# Altium schematic sheet P15-EXP_IO.SchDoc
size 817 x 513 mm
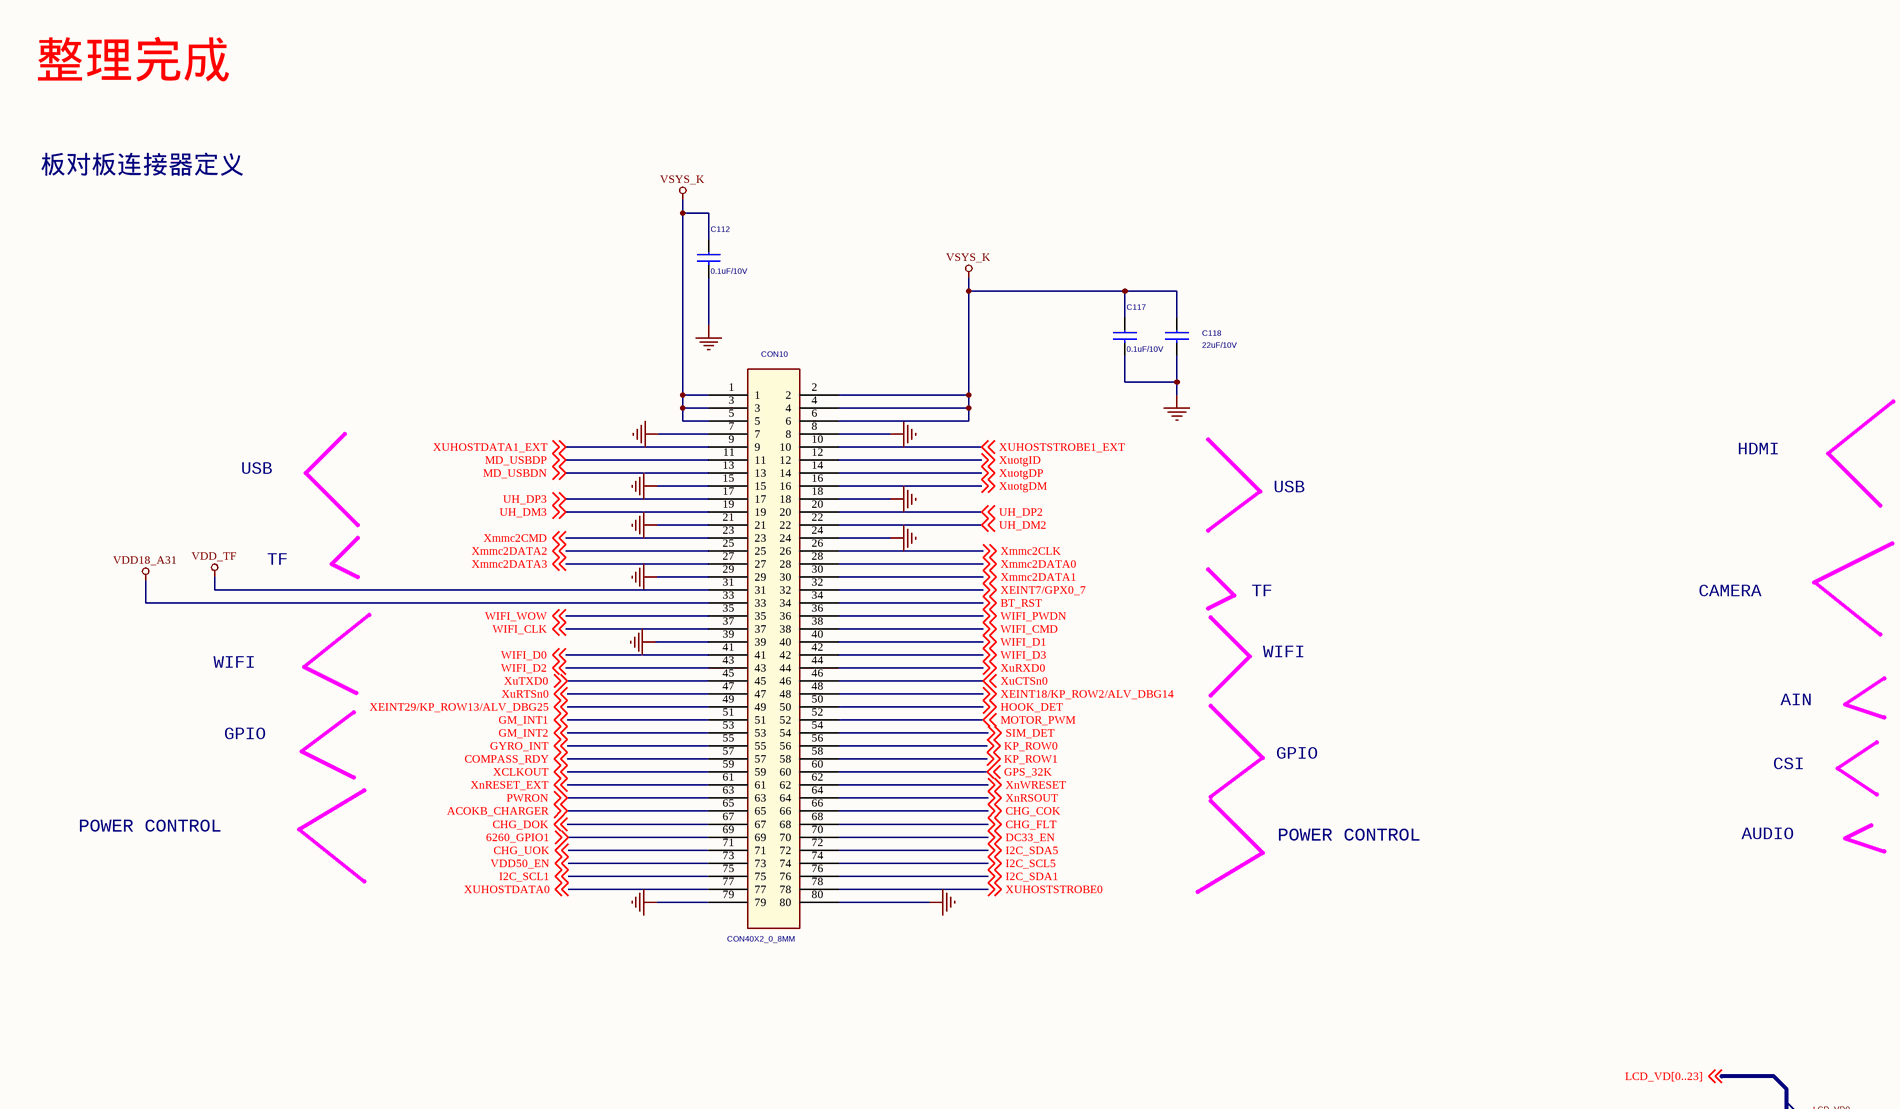
[diagram p0: P15-EXP_IO.SchDoc, top left]
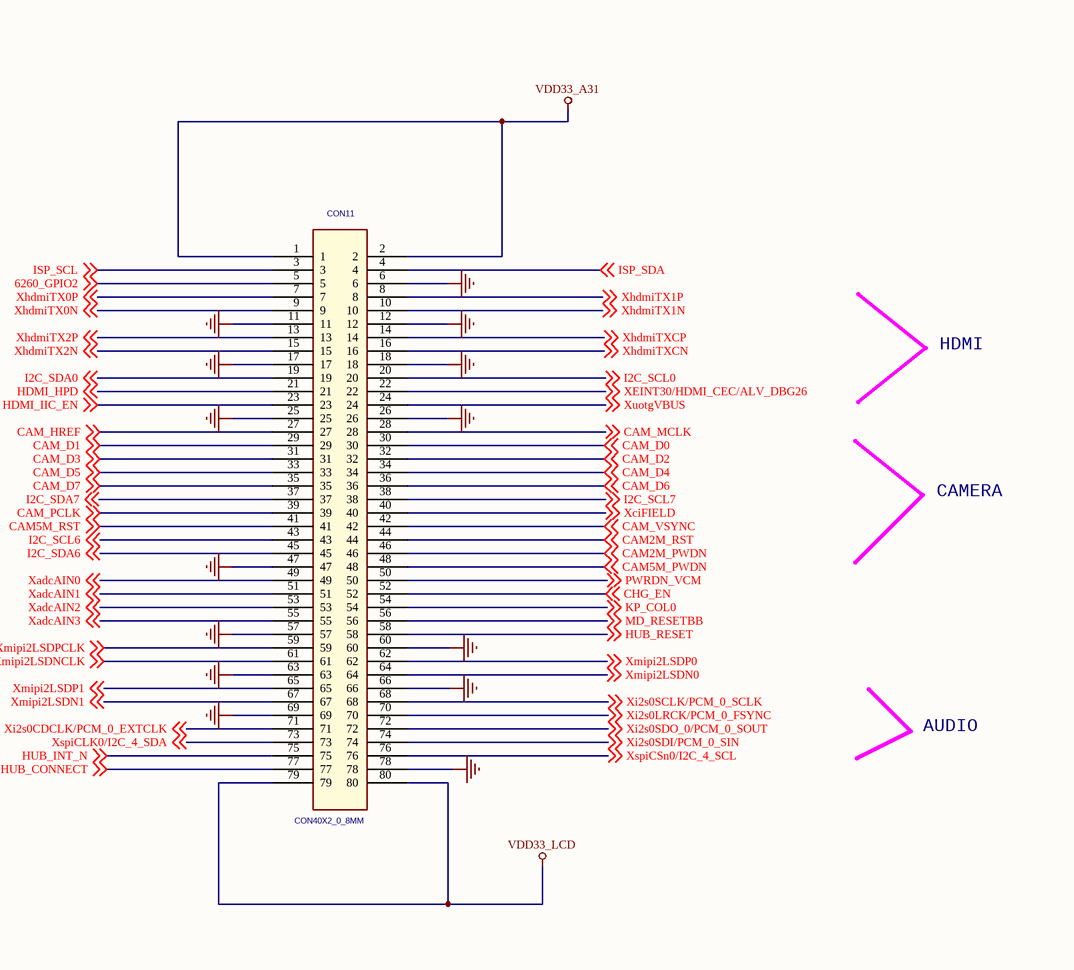
[diagram p1: P15-EXP_IO.SchDoc, top right]
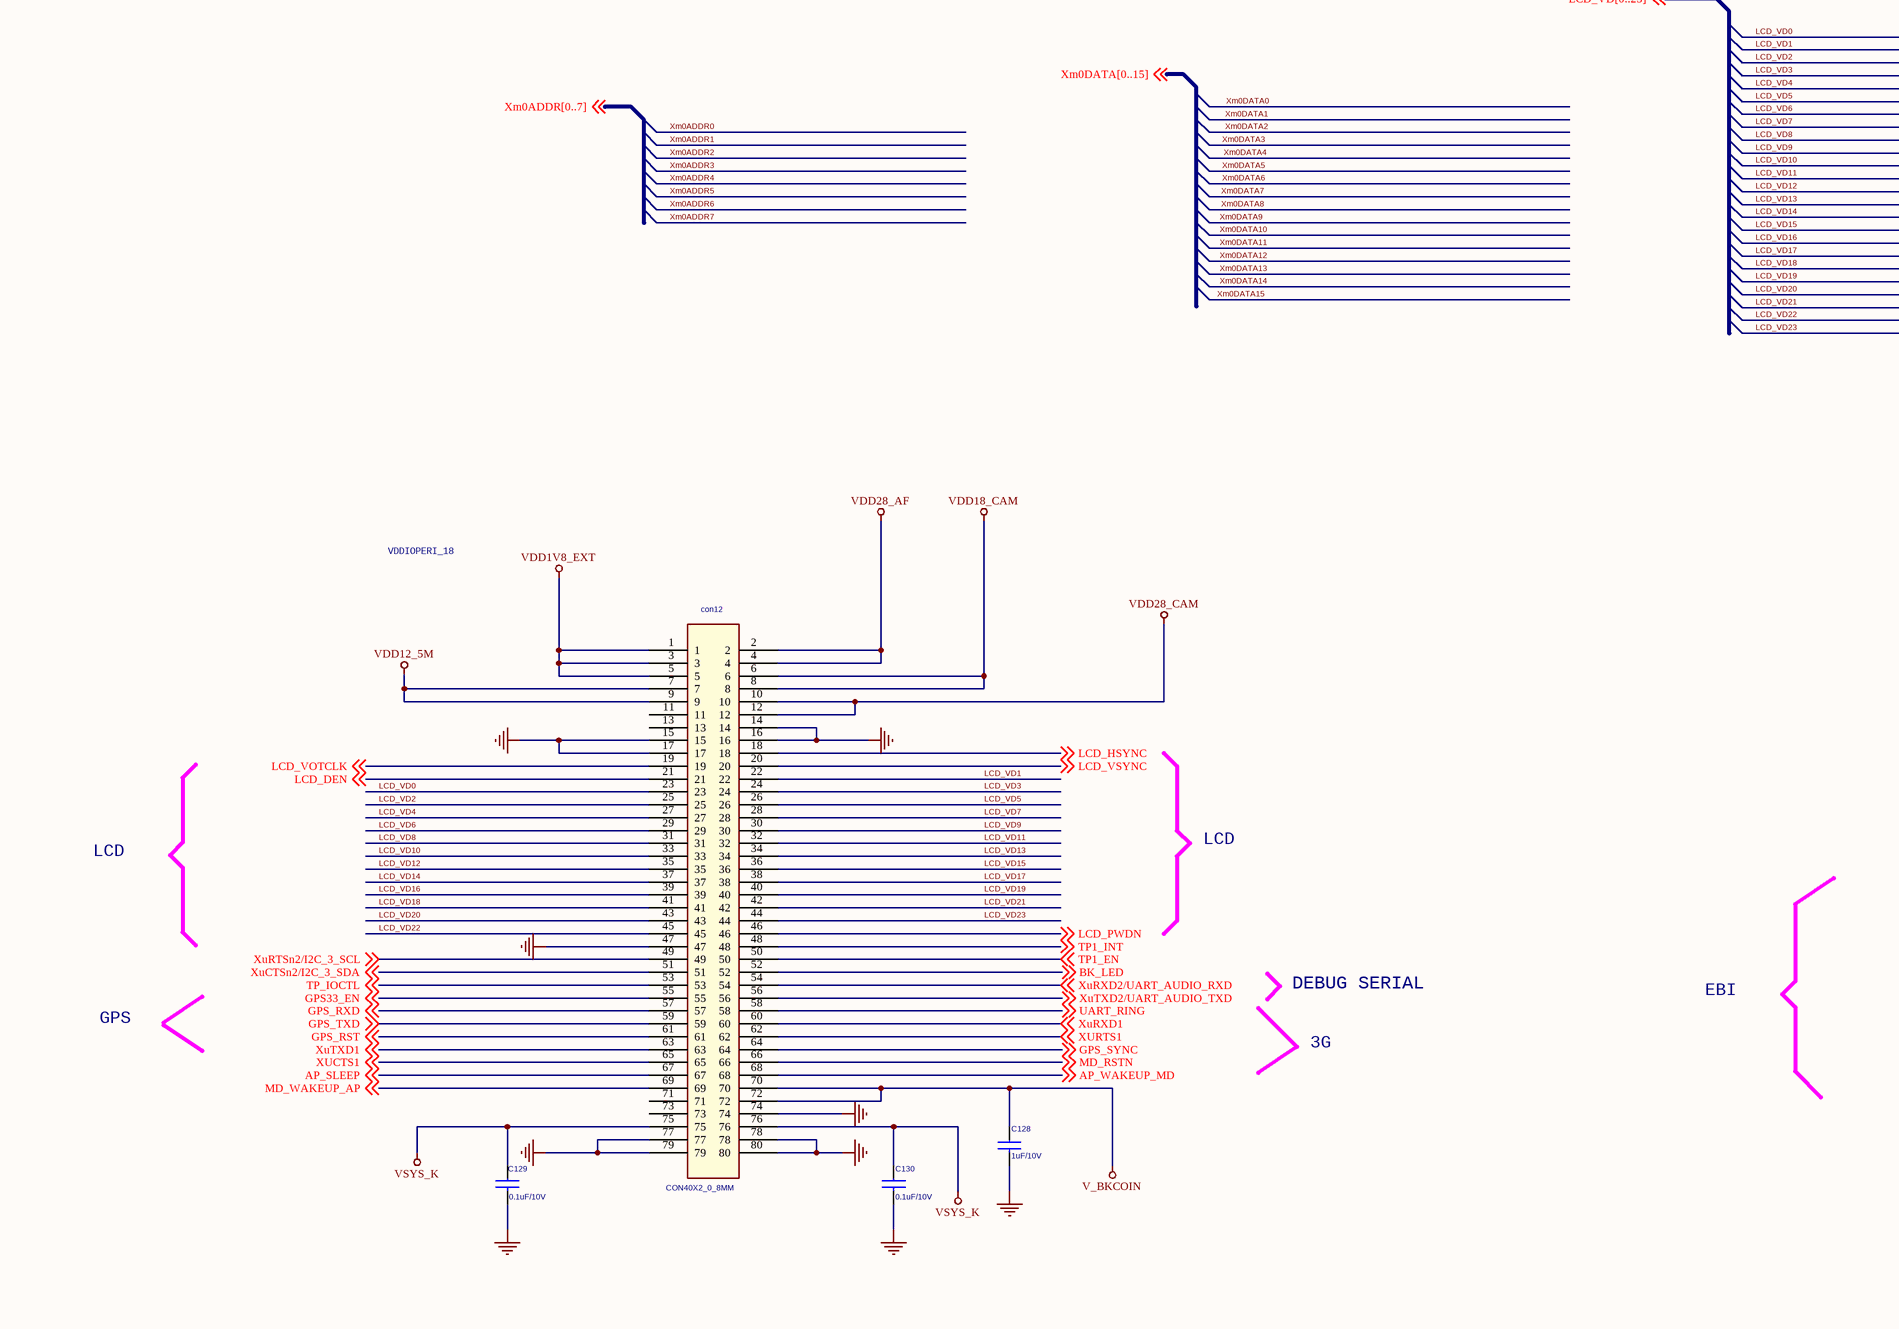
[diagram p2: P15-EXP_IO.SchDoc, bottom left]
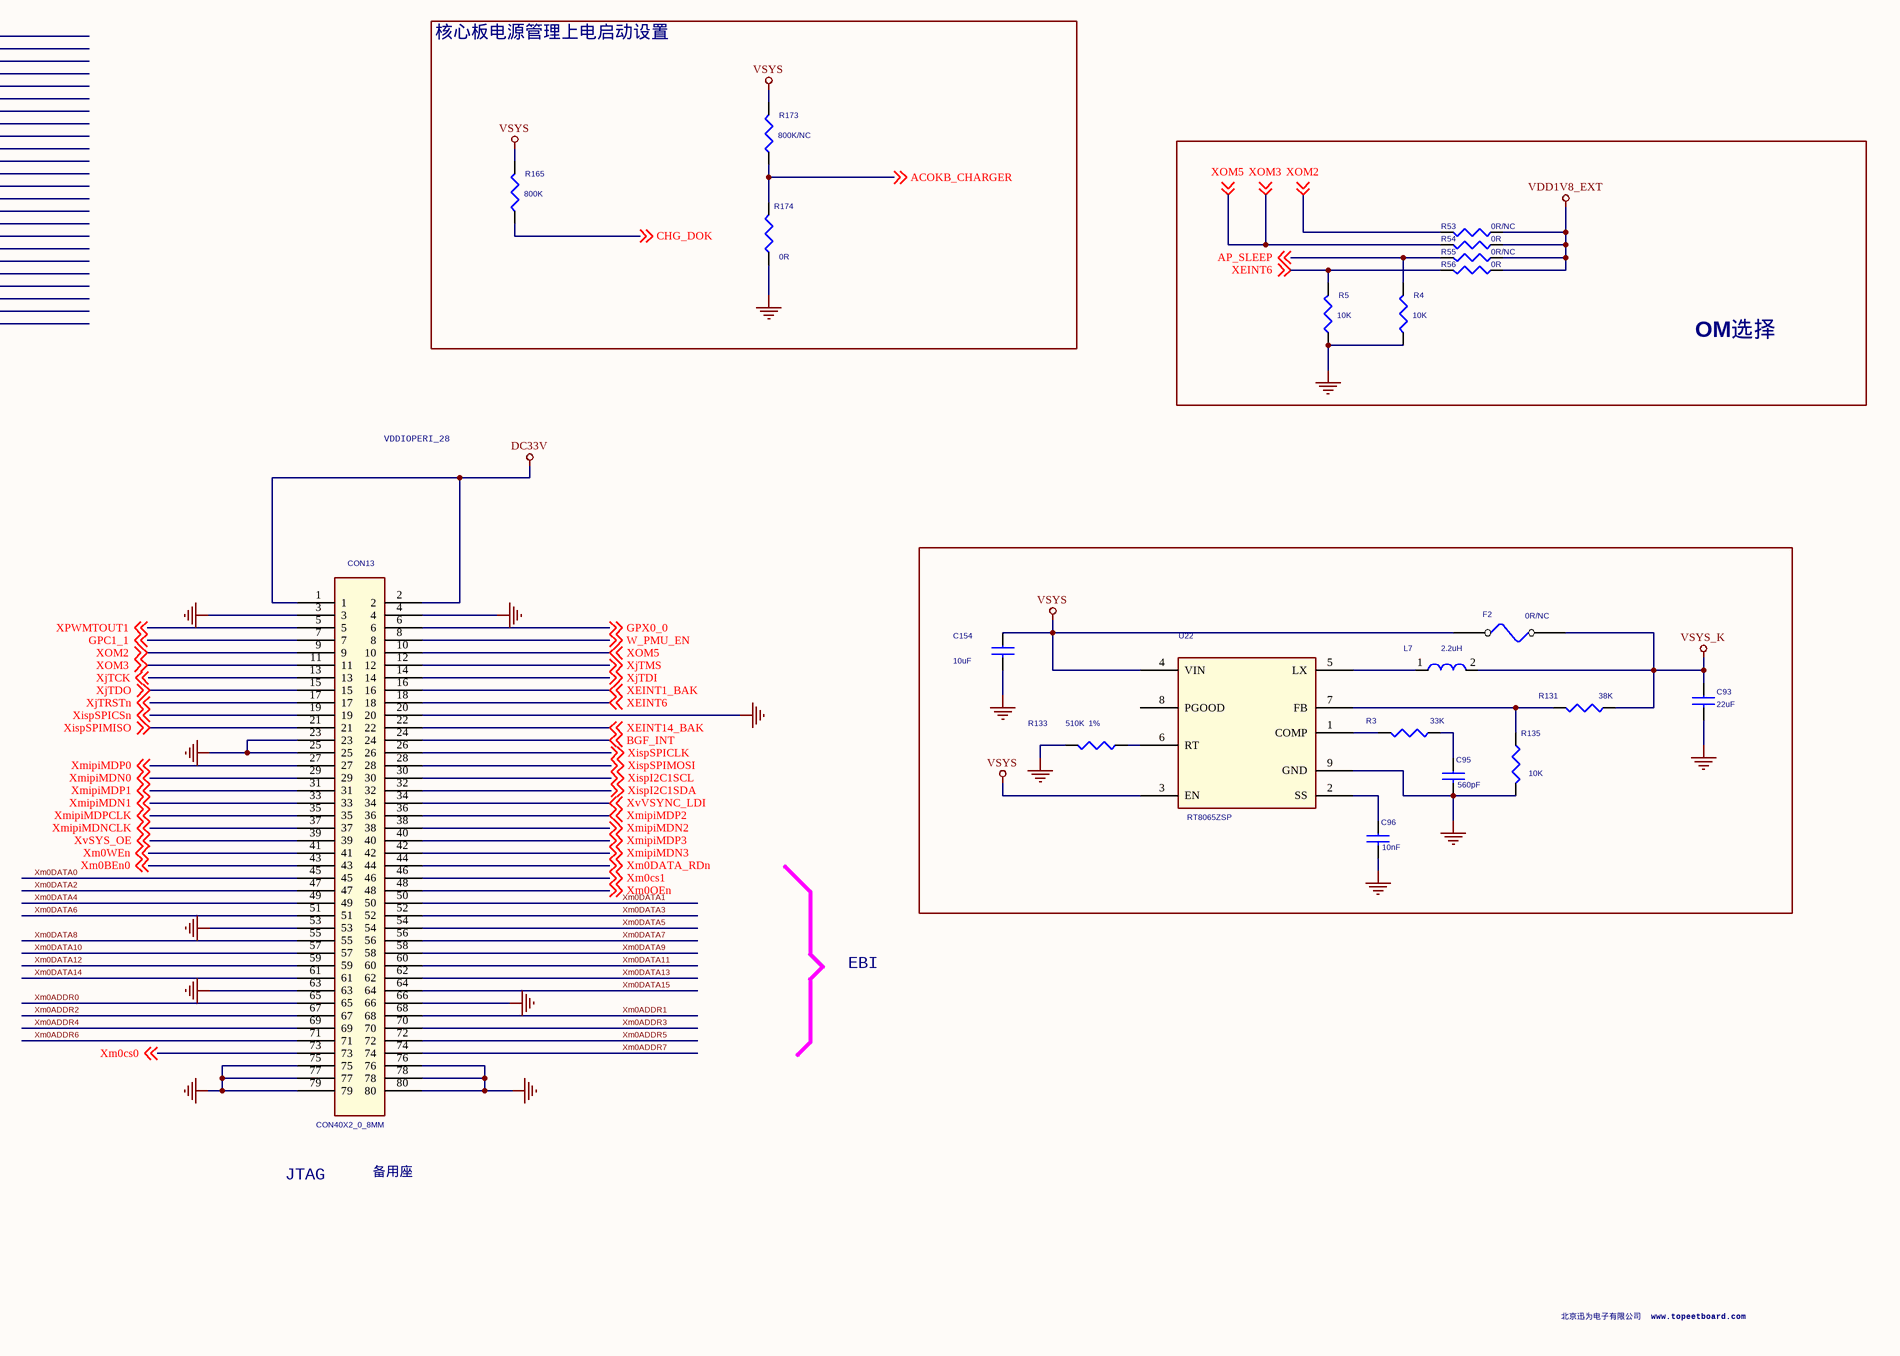
[diagram p3: P15-EXP_IO.SchDoc, bottom right]

## Parts
C93  22uF  [C0805-S]
C95  560pF  [C0603-S]
C96  10nF  [C0603-S]
C112  0.1uF/10V  [C0603-S]
C117  0.1uF/10V  [C0603-S]
C118  22uF/10V  [C1206-S]
C128  1uF/10V  [C0603-S]
C129  0.1uF/10V  [C0603-S]
C130  0.1uF/10V  [C0603-S]
C154  10uF  [C0603-S]
CON10  CON40X2_0_8MM  [CON2X40-0_5MM-BB]
CON11  CON40X2_0_8MM  [CON2X40-0_5MM-BB]
con12  CON40X2_0_8MM  [CON2X40-0_5MM-BB]
CON13  CON40X2_0_8MM  [CON2X40-0_5MM-BB]
F2  0R/NC  [F1206]
L7  2.2uH  [L3X3MM]
R3  33K  [R0603-S]
R4  10K  [R0603-S]
R5  10K  [R0603-S]
R53  0R/NC  [R0603-S]
R54  0R  [R0603-S]
R55  0R/NC  [R0603-S]
R56  0R  [R0603-S]
R131  38K  [R0603-S]
R133  510K  1%  [R0603-S]
R135  10K  [R0603-S]
R165  800K  [R0603-S]
R173  800K/NC  [R0603-S]
R174  0R  [R0603-S]
U22  RT8065ZSP  [soic8-lh]

## Blocks framed on the sheet
核心板电源管理上电启动设置: R165 R173 R174
OM选择: R4 R5 R53-R56

## Nets
DC33V: CON13.1 CON13.2
GND: C93.2 C95.2 C96.2 C112.2 C117.2 C118.2 C128.2 C129.2 C130.2 C154.2 CON10.7 CON10.8 CON10.15 CON10.18 CON10.21 CON10.24 CON10.29 CON10.39 CON10.79 CON10.80 CON11.6 CON11.11 CON11.12 CON11.17 CON11.18 CON11.25 CON11.26 CON11.47 CON11.57 CON11.60 CON11.63 CON11.66 CON11.69 CON11.78 con12.14 con12.15 con12.16 con12.17 con12.47 con12.74 con12.77 con12.78 con12.79 con12.80 CON13.3 CON13.4 CON13.20 CON13.23 CON13.25 CON13.53 CON13.63 CON13.66 CON13.75 CON13.76 CON13.77 CON13.78 CON13.79 CON13.80 R4.1 R5.1 R133.2 R135.2 R174.1 U22.9(GND)
V_BKCOIN: C128.1 con12.70 con12.72
VDD1V8_EXT: con12.1 con12.3 con12.5 R53.1 R54.1 R55.1 R56.1
VDD12_5M: con12.7 con12.9
VDD18_A31: CON10.33
VDD18_CAM: con12.6 con12.8
VDD28_AF: con12.2 con12.4
VDD28_CAM: con12.10 con12.12
VDD33_A31: CON11.1 CON11.2
VDD33_LCD: CON11.79 CON11.80
VDD_TF: CON10.31
VSYS: C154.1 F2.1 R165.2 R173.2 U22.3(EN) U22.4(VIN)
VSYS_K: C93.1 C112.1 C117.1 C118.1 C129.1 C130.1 CON10.1 CON10.2 CON10.3 CON10.4 CON10.5 CON10.6 con12.75 con12.76 F2.2 L7.2 R131.1
6260_GPIO1: CON10.69 ; off-sheet 6260_GPIO1
6260_GPIO2: CON11.5 ; off-sheet 6260_GPIO2
ACOKB_CHARGER: CON10.65 R173.1 R174.2 ; off-sheet ACOKB_CHARGER
AP_SLEEP: con12.67 R4.2 R55.2 ; off-sheet AP_SLEEP
AP_WAKEUP_MD: con12.68 ; off-sheet AP_WAKEUP_MD
BGF_INT: CON13.24 ; off-sheet BGF_INT
BK_LED: con12.52 ; off-sheet BK_LED
BT_RST: CON10.34 ; off-sheet BT_RST
CAM2M_PWDN: CON11.46 ; off-sheet CAM2M_PWDN
CAM2M_RST: CON11.44 ; off-sheet CAM2M_RST
CAM5M_PWDN: CON11.48 ; off-sheet CAM5M_PWDN
CAM5M_RST: CON11.41 ; off-sheet CAM5M_RST
CAM_D0: CON11.30 ; off-sheet CAM_D0
CAM_D1: CON11.29 ; off-sheet CAM_D1
CAM_D2: CON11.32 ; off-sheet CAM_D2
CAM_D3: CON11.31 ; off-sheet CAM_D3
CAM_D4: CON11.34 ; off-sheet CAM_D4
CAM_D5: CON11.33 ; off-sheet CAM_D5
CAM_D6: CON11.36 ; off-sheet CAM_D6
CAM_D7: CON11.35 ; off-sheet CAM_D7
CAM_HREF: CON11.27 ; off-sheet CAM_HREF
CAM_MCLK: CON11.28 ; off-sheet CAM_MCLK
CAM_PCLK: CON11.39 ; off-sheet CAM_PCLK
CAM_VSYNC: CON11.42 ; off-sheet CAM_VSYNC
CHG_COK: CON10.66 ; off-sheet CHG_COK
CHG_DOK: CON10.67 R165.1 ; off-sheet CHG_DOK
CHG_EN: CON11.52 ; off-sheet CHG_EN
CHG_FLT: CON10.68 ; off-sheet CHG_FLT
CHG_UOK: CON10.71 ; off-sheet CHG_UOK
COMPASS_RDY: CON10.57 ; off-sheet COMPASS_RDY
DC33_EN: CON10.70 ; off-sheet DC33_EN
GM_INT1: CON10.51 ; off-sheet GM_INT1
GM_INT2: CON10.53 ; off-sheet GM_INT2
GPC1_1: CON13.7 ; off-sheet GPC1_1
GPS33_EN: con12.55 ; off-sheet GPS33_EN
GPS_32K: CON10.60 ; off-sheet GPS_32K
GPS_RST: con12.61 ; off-sheet GPS_RST
GPS_RXD: con12.57 ; off-sheet GPS_RXD
GPS_SYNC: con12.64 ; off-sheet GPS_SYNC
GPS_TXD: con12.59 ; off-sheet GPS_TXD
GPX0_0: CON13.6 ; off-sheet GPX0_0
GYRO_INT: CON10.55 ; off-sheet GYRO_INT
HDMI_HPD: CON11.21 ; off-sheet HDMI_HPD
HDMI_IIC_EN: CON11.23 ; off-sheet HDMI_IIC_EN
HOOK_DET: CON10.50 ; off-sheet HOOK_DET
HUB_CONNECT: CON11.77 ; off-sheet HUB_CONNECT
HUB_INT_N: CON11.75 ; off-sheet HUB_INT_N
HUB_RESET: CON11.58 ; off-sheet HUB_RESET
I2C_SCL0: CON11.20 ; off-sheet I2C_SCL0
I2C_SCL1: CON10.75 ; off-sheet I2C_SCL1
I2C_SCL5: CON10.74 ; off-sheet I2C_SCL5
I2C_SCL6: CON11.43 ; off-sheet I2C_SCL6
I2C_SCL7: CON11.38 ; off-sheet I2C_SCL7
I2C_SDA0: CON11.19 ; off-sheet I2C_SDA0
I2C_SDA1: CON10.76 ; off-sheet I2C_SDA1
I2C_SDA5: CON10.72 ; off-sheet I2C_SDA5
I2C_SDA6: CON11.45 ; off-sheet I2C_SDA6
I2C_SDA7: CON11.37 ; off-sheet I2C_SDA7
ISP_SCL: CON11.3 ; off-sheet ISP_SCL
ISP_SDA: CON11.4 ; off-sheet ISP_SDA
KP_COL0: CON11.54 ; off-sheet KP_COL0
KP_ROW0: CON10.56 ; off-sheet KP_ROW0
KP_ROW1: CON10.58 ; off-sheet KP_ROW1
LCD_DEN: con12.21 ; off-sheet LCD_DEN
LCD_HSYNC: con12.18 ; off-sheet LCD_HSYNC
LCD_PWDN: con12.46 ; off-sheet LCD_PWDN
LCD_VD0: con12.23
LCD_VD1: con12.22
LCD_VD2: con12.25
LCD_VD3: con12.24
LCD_VD4: con12.27
LCD_VD5: con12.26
LCD_VD6: con12.29
LCD_VD7: con12.28
LCD_VD8: con12.31
LCD_VD9: con12.30
LCD_VD10: con12.33
LCD_VD11: con12.32
LCD_VD12: con12.35
LCD_VD13: con12.34
LCD_VD14: con12.37
LCD_VD15: con12.36
LCD_VD16: con12.39
LCD_VD17: con12.38
LCD_VD18: con12.41
LCD_VD19: con12.40
LCD_VD20: con12.43
LCD_VD21: con12.42
LCD_VD22: con12.45
LCD_VD23: con12.44
LCD_VOTCLK: con12.19 ; off-sheet LCD_VOTCLK
LCD_VSYNC: con12.20 ; off-sheet LCD_VSYNC
MD_RESETBB: CON11.56 ; off-sheet MD_RESETBB
MD_RSTN: con12.66 ; off-sheet MD_RSTN
MD_USBDN: CON10.13 ; off-sheet MD_USBDN
MD_USBDP: CON10.11 ; off-sheet MD_USBDP
MD_WAKEUP_AP: con12.69 ; off-sheet MD_WAKEUP_AP
MOTOR_PWM: CON10.52 ; off-sheet MOTOR_PWM
PWRDN_VCM: CON11.50 ; off-sheet PWRDN_VCM
PWRON: CON10.63 ; off-sheet PWRON
SIM_DET: CON10.54 ; off-sheet SIM_DET
TP1_EN: con12.50 ; off-sheet TP1_EN
TP1_INT: con12.48 ; off-sheet TP1_INT
TP_IOCTL: con12.53 ; off-sheet TP_IOCTL
UART_RING: con12.58 ; off-sheet UART_RING
UH_DM2: CON10.22 ; off-sheet UH_DM2
UH_DM3: CON10.19 ; off-sheet UH_DM3
UH_DP2: CON10.20 ; off-sheet UH_DP2
UH_DP3: CON10.17 ; off-sheet UH_DP3
VDD50_EN: CON10.73 ; off-sheet VDD50_EN
W_PMU_EN: CON13.8 ; off-sheet W_PMU_EN
WIFI_CLK: CON10.37 ; off-sheet WIFI_CLK
WIFI_CMD: CON10.38 ; off-sheet WIFI_CMD
WIFI_D0: CON10.41 ; off-sheet WIFI_D0
WIFI_D1: CON10.40 ; off-sheet WIFI_D1
WIFI_D2: CON10.43 ; off-sheet WIFI_D2
WIFI_D3: CON10.42 ; off-sheet WIFI_D3
WIFI_PWDN: CON10.36 ; off-sheet WIFI_PWDN
WIFI_WOW: CON10.35 ; off-sheet WIFI_WOW
XadcAIN0: CON11.49 ; off-sheet XadcAIN0
XadcAIN1: CON11.51 ; off-sheet XadcAIN1
XadcAIN2: CON11.53 ; off-sheet XadcAIN2
XadcAIN3: CON11.55 ; off-sheet XadcAIN3
XciFIELD: CON11.40 ; off-sheet XciFIELD
XCLKOUT: CON10.59 ; off-sheet XCLKOUT
XEINT1_BAK: CON13.16 ; off-sheet XEINT1_BAK
XEINT6: CON13.18 R5.2 R56.2 ; off-sheet XEINT6
XEINT7/GPX0_7: CON10.32 ; off-sheet XEINT7/GPX0_7
XEINT14_BAK: CON13.22 ; off-sheet XEINT14_BAK
XEINT18/KP_ROW2/ALV_DBG14: CON10.48 ; off-sheet XEINT18/KP_ROW2/ALV_DBG14
XEINT29/KP_ROW13/ALV_DBG25: CON10.49 ; off-sheet XEINT29/KP_ROW13/ALV_DBG25
XEINT30/HDMI_CEC/ALV_DBG26: CON11.22 ; off-sheet XEINT30/HDMI_CEC/ALV_DBG26
XhdmiTX0N: CON11.9 ; off-sheet XhdmiTX0N
XhdmiTX0P: CON11.7 ; off-sheet XhdmiTX0P
XhdmiTX1N: CON11.10 ; off-sheet XhdmiTX1N
XhdmiTX1P: CON11.8 ; off-sheet XhdmiTX1P
XhdmiTX2N: CON11.15 ; off-sheet XhdmiTX2N
XhdmiTX2P: CON11.13 ; off-sheet XhdmiTX2P
XhdmiTXCN: CON11.16 ; off-sheet XhdmiTXCN
XhdmiTXCP: CON11.14 ; off-sheet XhdmiTXCP
Xi2s0CDCLK/PCM_0_EXTCLK: CON11.71 ; off-sheet Xi2s0CDCLK/PCM_0_EXTCLK
Xi2s0LRCK/PCM_0_FSYNC: CON11.70 ; off-sheet Xi2s0LRCK/PCM_0_FSYNC
Xi2s0SCLK/PCM_0_SCLK: CON11.68 ; off-sheet Xi2s0SCLK/PCM_0_SCLK
Xi2s0SDI/PCM_0_SIN: CON11.74 ; off-sheet Xi2s0SDI/PCM_0_SIN
Xi2s0SDO_0/PCM_0_SOUT: CON11.72 ; off-sheet Xi2s0SDO_0/PCM_0_SOUT
XispI2C1SCL: CON13.30 ; off-sheet XispI2C1SCL
XispI2C1SDA: CON13.32 ; off-sheet XispI2C1SDA
XispSPICLK: CON13.26 ; off-sheet XispSPICLK
XispSPICSn: CON13.19 ; off-sheet XispSPICSn
XispSPIMISO: CON13.21 ; off-sheet XispSPIMISO
XispSPIMOSI: CON13.28 ; off-sheet XispSPIMOSI
XjTCK: CON13.13 ; off-sheet XjTCK
XjTDI: CON13.14 ; off-sheet XjTDI
XjTDO: CON13.15 ; off-sheet XjTDO
XjTMS: CON13.12 ; off-sheet XjTMS
XjTRSTn: CON13.17 ; off-sheet XjTRSTn
Xm0ADDR0: CON13.65
Xm0ADDR1: CON13.68
Xm0ADDR2: CON13.67
Xm0ADDR3: CON13.70
Xm0ADDR4: CON13.69
Xm0ADDR5: CON13.72
Xm0ADDR6: CON13.71
Xm0ADDR7: CON13.74
Xm0BEn0: CON13.43 ; off-sheet Xm0BEn0
Xm0cs0: CON13.73 ; off-sheet Xm0cs0
Xm0cs1: CON13.46 ; off-sheet Xm0cs1
Xm0DATA0: CON13.45
Xm0DATA1: CON13.50
Xm0DATA2: CON13.47
Xm0DATA3: CON13.52
Xm0DATA4: CON13.49
Xm0DATA5: CON13.54
Xm0DATA6: CON13.51
Xm0DATA7: CON13.56
Xm0DATA8: CON13.55
Xm0DATA9: CON13.58
Xm0DATA10: CON13.57
Xm0DATA11: CON13.60
Xm0DATA12: CON13.59
Xm0DATA13: CON13.62
Xm0DATA14: CON13.61
Xm0DATA15: CON13.64
Xm0DATA_RDn: CON13.44 ; off-sheet Xm0DATA_RDn
Xm0OEn: CON13.48 ; off-sheet Xm0OEn
Xm0WEn: CON13.41 ; off-sheet Xm0WEn
Xmipi2LSDN0: CON11.64 ; off-sheet Xmipi2LSDN0
Xmipi2LSDN1: CON11.67 ; off-sheet Xmipi2LSDN1
Xmipi2LSDNCLK: CON11.61 ; off-sheet Xmipi2LSDNCLK
Xmipi2LSDP0: CON11.62 ; off-sheet Xmipi2LSDP0
Xmipi2LSDP1: CON11.65 ; off-sheet Xmipi2LSDP1
Xmipi2LSDPCLK: CON11.59 ; off-sheet Xmipi2LSDPCLK
XmipiMDN0: CON13.29 ; off-sheet XmipiMDN0
XmipiMDN1: CON13.33 ; off-sheet XmipiMDN1
XmipiMDN2: CON13.38 ; off-sheet XmipiMDN2
XmipiMDN3: CON13.42 ; off-sheet XmipiMDN3
XmipiMDNCLK: CON13.37 ; off-sheet XmipiMDNCLK
XmipiMDP0: CON13.27 ; off-sheet XmipiMDP0
XmipiMDP1: CON13.31 ; off-sheet XmipiMDP1
XmipiMDP2: CON13.36 ; off-sheet XmipiMDP2
XmipiMDP3: CON13.40 ; off-sheet XmipiMDP3
XmipiMDPCLK: CON13.35 ; off-sheet XmipiMDPCLK
Xmmc2CLK: CON10.26 ; off-sheet Xmmc2CLK
Xmmc2CMD: CON10.23 ; off-sheet Xmmc2CMD
Xmmc2DATA0: CON10.28 ; off-sheet Xmmc2DATA0
Xmmc2DATA1: CON10.30 ; off-sheet Xmmc2DATA1
Xmmc2DATA2: CON10.25 ; off-sheet Xmmc2DATA2
Xmmc2DATA3: CON10.27 ; off-sheet Xmmc2DATA3
XnRESET_EXT: CON10.61 ; off-sheet XnRESET_EXT
XnRSOUT: CON10.64 ; off-sheet XnRSOUT
XnWRESET: CON10.62 ; off-sheet XnWRESET
XOM2: CON13.9 R53.2 ; off-sheet XOM2
XOM3: CON13.10 CON13.11 R54.2 ; off-sheet XOM5, off-sheet XOM3  [also labelled XOM5]
XPWMTOUT1: CON13.5 ; off-sheet XPWMTOUT1
XspiCLK0/I2C_4_SDA: CON11.73 ; off-sheet XspiCLK0/I2C_4_SDA
XspiCSn0/I2C_4_SCL: CON11.76 ; off-sheet XspiCSn0/I2C_4_SCL
XUCTS1: con12.65 ; off-sheet XUCTS1
XuCTSn0: CON10.46 ; off-sheet XuCTSn0
XuCTSn2/I2C_3_SDA: con12.51 ; off-sheet XuCTSn2/I2C_3_SDA
XUHOSTDATA0: CON10.77 ; off-sheet XUHOSTDATA0
XUHOSTDATA1_EXT: CON10.9 ; off-sheet XUHOSTDATA1_EXT
XUHOSTSTROBE0: CON10.78 ; off-sheet XUHOSTSTROBE0
XUHOSTSTROBE1_EXT: CON10.10 ; off-sheet XUHOSTSTROBE1_EXT
XuotgDM: CON10.16 ; off-sheet XuotgDM
XuotgDP: CON10.14 ; off-sheet XuotgDP
XuotgID: CON10.12 ; off-sheet XuotgID
XuotgVBUS: CON11.24 ; off-sheet XuotgVBUS
XURTS1: con12.62 ; off-sheet XURTS1
XuRTSn0: CON10.47 ; off-sheet XuRTSn0
XuRTSn2/I2C_3_SCL: con12.49 ; off-sheet XuRTSn2/I2C_3_SCL
XuRXD0: CON10.44 ; off-sheet XuRXD0
XuRXD1: con12.60 ; off-sheet XuRXD1
XuRXD2/UART_AUDIO_RXD: con12.54 ; off-sheet XuRXD2/UART_AUDIO_RXD
XuTXD0: CON10.45 ; off-sheet XuTXD0
XuTXD1: con12.63 ; off-sheet XuTXD1
XuTXD2/UART_AUDIO_TXD: con12.56 ; off-sheet XuTXD2/UART_AUDIO_TXD
XvSYS_OE: CON13.39 ; off-sheet XvSYS_OE
XvVSYNC_LDI: CON13.34 ; off-sheet XvVSYNC_LDI
NetC95_1: C95.1 R3.1
NetC96_1: C96.1 U22.2(SS)
NetL7_1: L7.1 U22.5(LX)
NetR3_2: R3.2 U22.1(COMP)
NetR131_2: R131.2 R135.1 U22.7(FB)
NetR133_1: R133.1 U22.6(RT)

Not connected (* = marked no-connect by the designer): con12 11 13 71 73; U22 8(PGOOD)

## Notes on the sheet
- 整理完成
- 板对板连接器定义
- USB
- HDMI
- TF
- CAMERA
- WIFI
- AIN
- GPIO
- CSI
- POWER CONTROL
- AUDIO
- VDDIOPERI_28
- VDDIOPERI_18
- LCD
- GPS
- DEBUG SERIAL
- 3G
- EBI
- JTAG
- 备用座
- 北京迅为电子有限公司  www.topeetboard.com

## Library data of the parts
C93 = C1005
C95 = CAP NP_3: CER CHIP 1U 10% X5R 0402 10V  L/F; MANUFACTURER_PN: LDK105BJ105KV-F; MANUFACTURER_NAME: TAIYOYUDEN; PART_TYPE: P06-Cer CAP; USI_PN: 06-210594-01; GREEN_STATUS: Green Part; TW_MM_PLANT: 1130;1120;1110;1140; SH_MM_PLANT: 1510,1511,1520,1521; SZ_MM_PLANT: 1240,1210,1260; SH_LEAD_TIME: 56; SH_UNITCOST: 0.034128632; SZ_UNITCOST: 0.024593249; SH_INVENTORY: 10000.000; SZ_INVENTORY: 0; REMARK: Update on 20090523; INVENTORY: 160698.000; UNITCOST: 0.006868; ROOM: BACKUP_BATT; BOM_GRP: PWR_BACKUP-BATT; USI_Description: CER CHIP 1U 10% X5R 0402 10V  L/F; SZ_LEAD_TIME: 56; SH_LASTBUY_DATE: 2009-03-31; SZ_LASTBUY_DATE: 2009-04-01; LEAD_TIME: 56; LASTBUY_DATE: 2007-07-01; LIFECYCLE: AMPL2; DATA_SHEET: http://pdmas.usi.com.tw/pdm?url=http://pdmap.usi.com.tw/Agile/PLMServlet?action=OpenEmailObject&classid=10000&objid=140990334; FOOTPRINT_LINK: smd_0402_cap.dra; PART_NUMBER: 06-210594-01; Component Type: 1UF; CHE: 0
C96 C154 = CAP NP_3: CER CHIP 1U 10% X5R 0402 10V  L/F; PART_NUMBER: 06-210594-01; PART_TYPE: P06-Cer CAP; MANUFACTURER_NAME: TAIYOYUDEN; MANUFACTURER_PN: LDK105BJ105KV-F; BOM_GRP: PWR_BACKUP-BATT; ROOM: BACKUP_BATT; CHE: 0; UNITCOST: 0.006868; INVENTORY: 160698.000; LEAD_TIME: 56; REMARK: Update on 20090523; SH_INVENTORY: 10000.000; SZ_UNITCOST: 0.024593249; SH_UNITCOST: 0.034128632; SZ_MM_PLANT: 1240,1210,1260; SH_MM_PLANT: 1510,1511,1520,1521; TW_MM_PLANT: 1130;1120;1110;1140; GREEN_STATUS: Green Part; Component Type: 1UF; FOOTPRINT_LINK: smd_0402_cap.dra; DATA_SHEET: http://pdmas.usi.com.tw/pdm?url=http://pdmap.usi.com.tw/Agile/PLMServlet?action=OpenEmailObject&classid=10000&objid=140990334; LIFECYCLE: AMPL2; LASTBUY_DATE: 2007-07-01; SZ_INVENTORY: 0; SZ_LASTBUY_DATE: 2009-04-01; SH_LASTBUY_DATE: 2009-03-31; SZ_LEAD_TIME: 56; SH_LEAD_TIME: 56; USI_Description: CER CHIP 1U 10% X5R 0402 10V  L/F; USI_PN: 06-210594-01
C112 C117 C129 C130 = C0402_0
C118 = C1206_0
C128 = C0603_0
F2 = FUSE
L7 = LQH32C_0
R3 R131 R133 R135 = R1005_0
R4 R5 R53-R56 R165 R173 R174 = R1005_0_Dup1
U22 = RT8065_3